# EAGLE design LipSync_Hub_PCB (EAGLE 9.6.2)
AUTHOR: ladyada
Assembly variants: Precert, PostCert
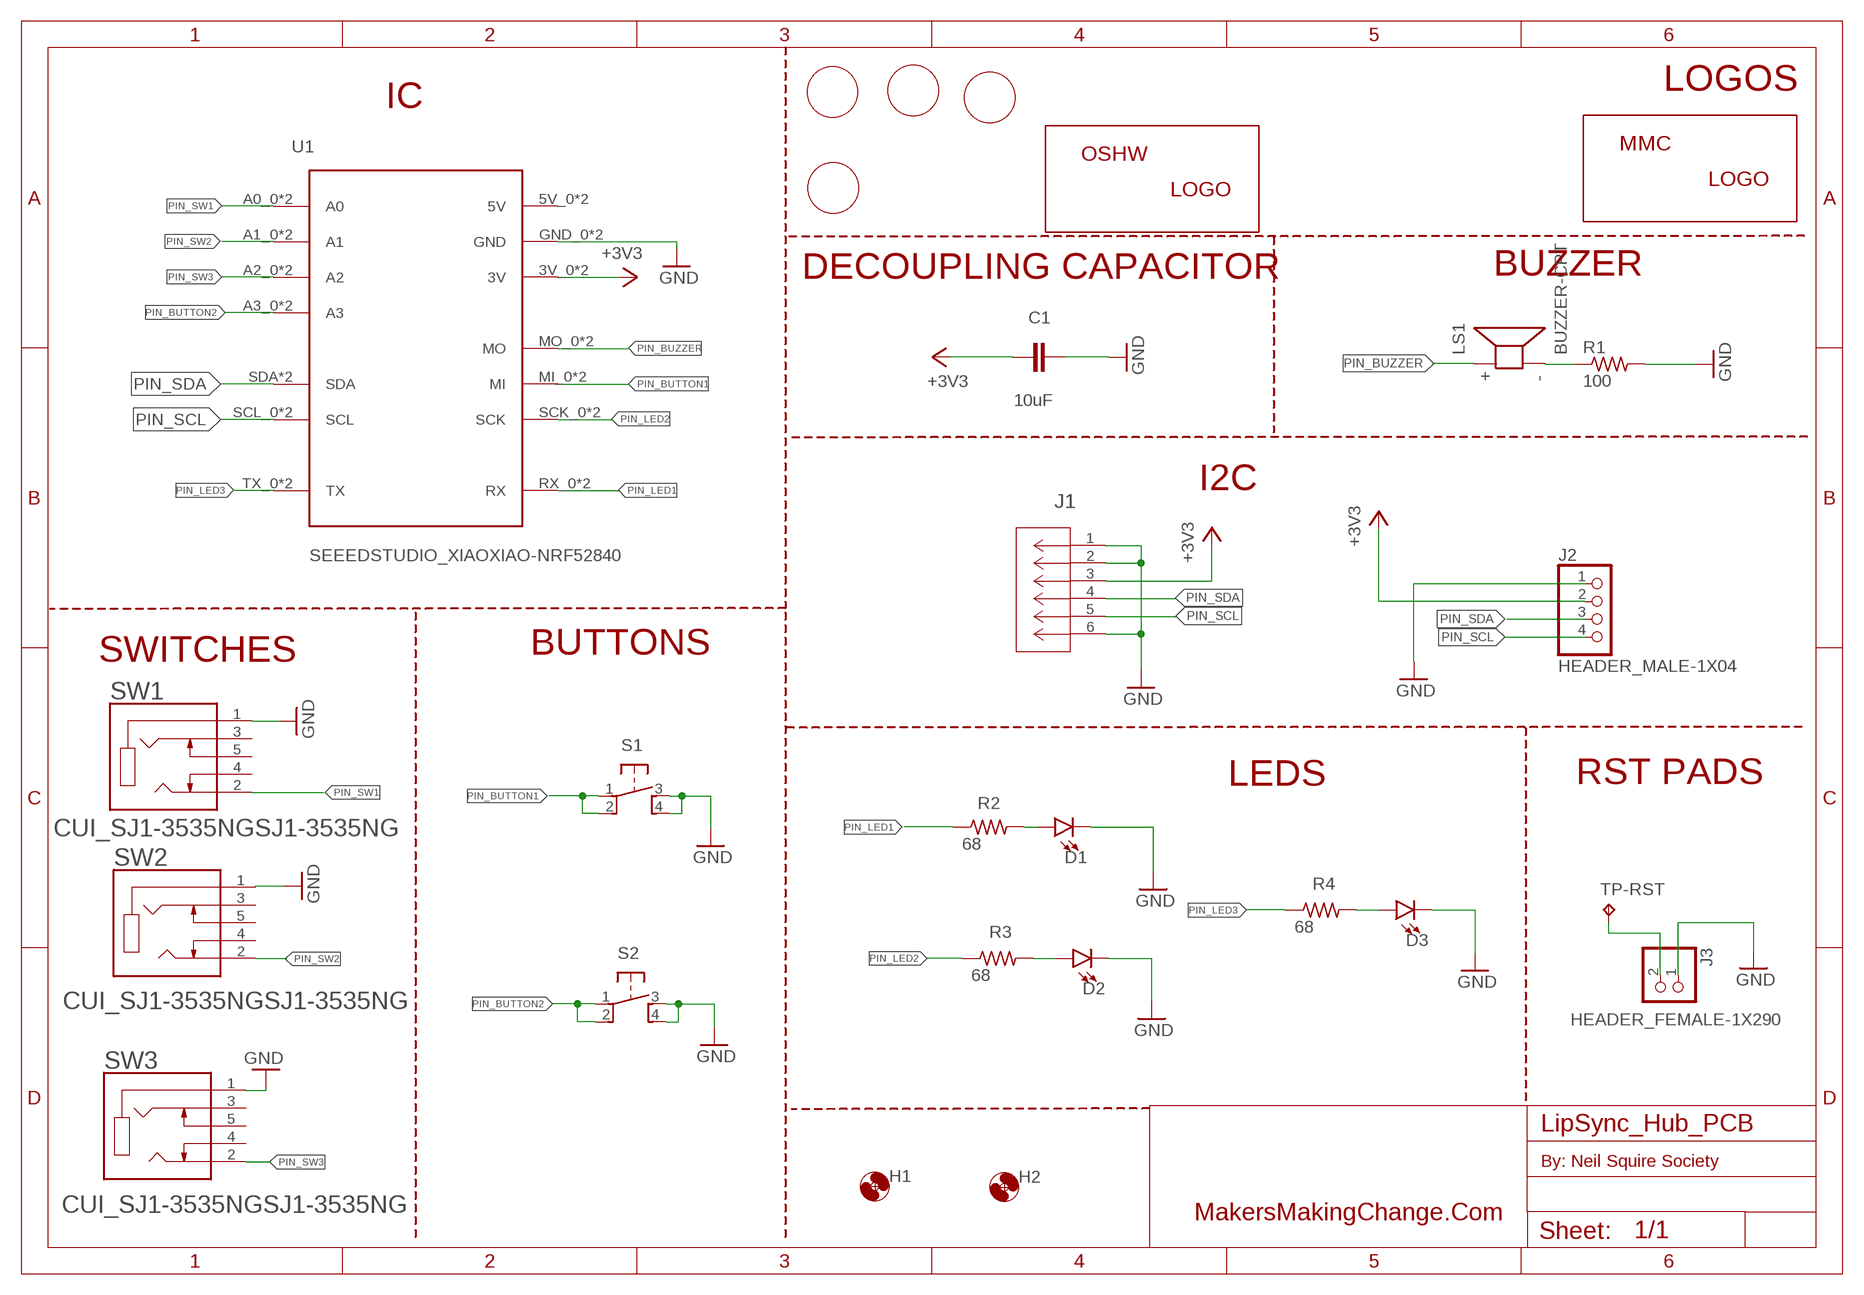
[diagram p0: schematic, sheet 1]

## Parts
C1  10uF  CAPACITOR-050-030-075  [CAP-050-030X075]
D1  LED_5MM-5MM-RED-LONG  [LED_5MM_RED_LONG]
D2  LED_5MM-5MM-RED-LONG  [LED_5MM_RED_LONG]
D3  LED_5MM-5MM-RED-LONG  [LED_5MM_RED_LONG]
H1  MOUNT-HOLE-3MM-CLEAR  [HOLE-3MM-CLEAR]
H2  MOUNT-HOLE-3MM-CLEAR  [HOLE-3MM-CLEAR]
J1  5555165-1  [CONN6_5555165-1]
J2  HEADER_MALE-1X04  [HEADER_MALE-1X04]
J3  HEADER_FEMALE-1X290  [HEADER_FEMALE-1X02_90]
LOGO-BACK  MMC_LABEL-BACK  [LABEL-BACK]
LOGO-FRONT  MMC_LABEL-FRONT  [LABEL-FRONT]
LOGO-LIPSYNC-BACK  MMC_LABEL-LIPSYNC-X-LG  [LABEL-LIPSYNC-X-LG]
LOGO-MMC-BACK  MMC_LOGO-MD  [MMC_MEDIUM_LOGO]
LOGO-NORTH  MMC_LABEL-UP  [LABEL-UP]
LOGO-OSWH  OSHW_LOGO-SM  [OSHW_SMALL_LOGO]  (not fitted in variant Precert)
LS1  BUZZER-CPT  [CUI_CPT-1255C-090]
R1  100  RESISTOR-US-0204/7  [RESISTOR_0205/7]
R2  68  RESISTOR-US-0204/7  [RESISTOR_0205/7]
R3  68  RESISTOR-US-0204/7  [RESISTOR_0205/7]
R4  68  RESISTOR-US-0204/7  [RESISTOR_0205/7]
S1  SWITCH_OMRON-PTH-12  [B3F-5050]
S2  SWITCH_OMRON-PTH-12  [B3F-5050]
SW1  CUI_SJ1-3535NGSJ1-3535NG  [CUI_SJ1-3535NG]
SW2  CUI_SJ1-3535NGSJ1-3535NG  [CUI_SJ1-3535NG]
SW3  CUI_SJ1-3535NGSJ1-3535NG  [CUI_SJ1-3535NG]
TP-RST  TESTPAD_TPB1,27  [TESTPAD_B1,27]
U1  SEEEDSTUDIO_XIAOXIAO-NRF52840  [SEEEDSTUDIO_XIAO_NRF52840]

## Nets
+3V3: C1.2 J1.3 J2.2 U1.3V_0(3V) U1.3V_1(3V)
GND: C1.1 D1.K(C) D2.K(C) D3.K(C) J1.1 J1.2 J1.6 J2.1 J3.1 R1.2 S1.3 S1.4 S2.3 S2.4 SW1.1 SW2.1 SW3.1 U1.GND_0(GND) U1.GND_1(GND)
N$1: LS1.N R1.1
N$2: D2.A R3.2
N$3: J3.2 TP-RST.TP
N$4: D3.A R4.2
N$5: D1.A R2.2
PIN_BUTTON1: S1.1 S1.2 U1.MI_0(MI) U1.MI_1(MI)
PIN_BUTTON2: S2.1 S2.2 U1.A3_0(A3) U1.A3_1(A3)
PIN_BUZZER: LS1.P U1.MO_0(MO) U1.MO_1(MO)
PIN_LED1: R2.1 U1.RX_0(RX) U1.RX_1(RX)
PIN_LED2: R3.1 U1.SCK_0(SCK) U1.SCK_1(SCK)
PIN_LED3: R4.1 U1.TX_0(TX) U1.TX_1(TX)
PIN_SCL: J1.5 J2.4 U1.SCL_0(SCL) U1.SCL_1(SCL)
PIN_SDA: J1.4 J2.3 U1.SDA U1.SDA_0(SDA)
PIN_SW1: SW1.2 U1.A0_0(A0) U1.A0_1(A0)
PIN_SW2: SW2.2 U1.A1_0(A1) U1.A1_1(A1)
PIN_SW3: SW3.2 U1.A2_0(A2) U1.A2_1(A2)
Unconnected: SW1.3 SW1.4 SW1.5 SW2.3 SW2.4 SW2.5 SW3.3 SW3.4 SW3.5 U1.5V_0(5V) U1.5V_1(5V)

## Notes on the sheet
- LOGOS
- IC
- DECOUPLING CAPACITOR | BUZZER
- I2C
- SWITCHES | BUTTONS
- LEDS | RST PADS
- By: Neil Squire Society
- MakersMakingChange.Com

## Library data of the parts
C1 = MMC Eagle:CAPACITOR-
D1-D3 = MMC Eagle:LED_5MM-: LED (Generic) Standard schematic elements and footprints for 5mm, 3mm, 1206, and 0603 sized LEDs. Generic LEDs with no color specified.
H1 H2 = MMC Eagle:MOUNT-HOLE-: MOUNTING HOLE with drill center marker
J1 = MMC Eagle:5555165-1; COPYRIGHT: Copyright (C) 2023 Ultra Librarian. All rights reserved.; MANUFACTURER_PART_NUMBER: 5555165-1; MFR_NAME: TE Connectivity
J2 = MMC Eagle:HEADER_MALE-1X04
J3 = MMC Eagle:HEADER_FEMALE-1X2
LOGO-BACK LOGO-FRONT LOGO-LIPSYNC-BACK LOGO-NORTH = MMC Eagle:MMC_LABEL-
LOGO-MMC-BACK = MMC Eagle:MMC_LOGO-
LOGO-OSWH = MMC Eagle:OSHW_LOGO-
LS1 = MMC Eagle:BUZZER: Buzzer Small round buzzers that operate around the audible 2kHz range. You can use these as speakers to create simple music or user interfaces. Options: PTH - Mini Speaker - PC Mount 12mm 2.048kHz <https://www.sparkfun.com/products/7950> PTH_KIT - Mini Speaker - PC Mount 12mm 2.048kHz <https://www.sparkfun.com/products/7950> KIT simplifies soldering by adding stop mask to one side of the pads. PTH_NO_SILK - Mini Speaker - PC Mount 12mm 2.048kHz <https://www.sparkfun.com/products/7950> No silkscreen indicator of buzzer outline. PTH_KIT_NO_SILK - Mini Speaker - PC Mount 12mm 2.048kHz <https://www.sparkfun.com/products/7950> KIT package w/o silkscreen SMD - Buzzer Audio Magnetic (CCV-084B16) SMD buzzer used on, e.g. the LilyPad Buzzer <https://www.sparkfun.com/products/8463> and RFID USB Reader <https://www.sparkfun.com/products/9963>. SMD_KIT - Buzzer Audio Magnetic (CCV-084B16) SMD Buzzer with elongated pins to make soldering easier. Used on the SparkFun Simon Says - Surface Mount Soldering Kit <https://www.sparkfun.com/products/10935>.
R1-R4 = MMC Eagle:RESISTOR-US-: RESISTOR, American symbol
S1 S2 = MMC Eagle:SWITCH_OMRON: OMRON SWITCH Now with beefier pads!
SW1-SW3 = MMC Eagle:CUI_SJ1-3535NG: SJ1-3535NG 3.50mm (0.141", 1/8", Mini Plug) - Headphone Phone Jack Stereo (3 Conductor, TRS) Connector. You can use these as jacks to create simple switch interfaces. Options: Digikey - CP1-3535NG-ND <https://www.digikey.ca/en/products/detail/cui-devices/SJ1-3535NG/738699> Mouser - 490-SJ1-3535NG <https://www.mouser.ca/ProductDetail/CUI-Devices/SJ1-3535NG?qs=WyjlAZoYn50jUmKVsqeRJw%3D%3D>
TP-RST = MMC_SMD:TESTPAD_TP: Test pad
U1 = MMC Eagle:SEEEDSTUDIO_XIAO

## Board
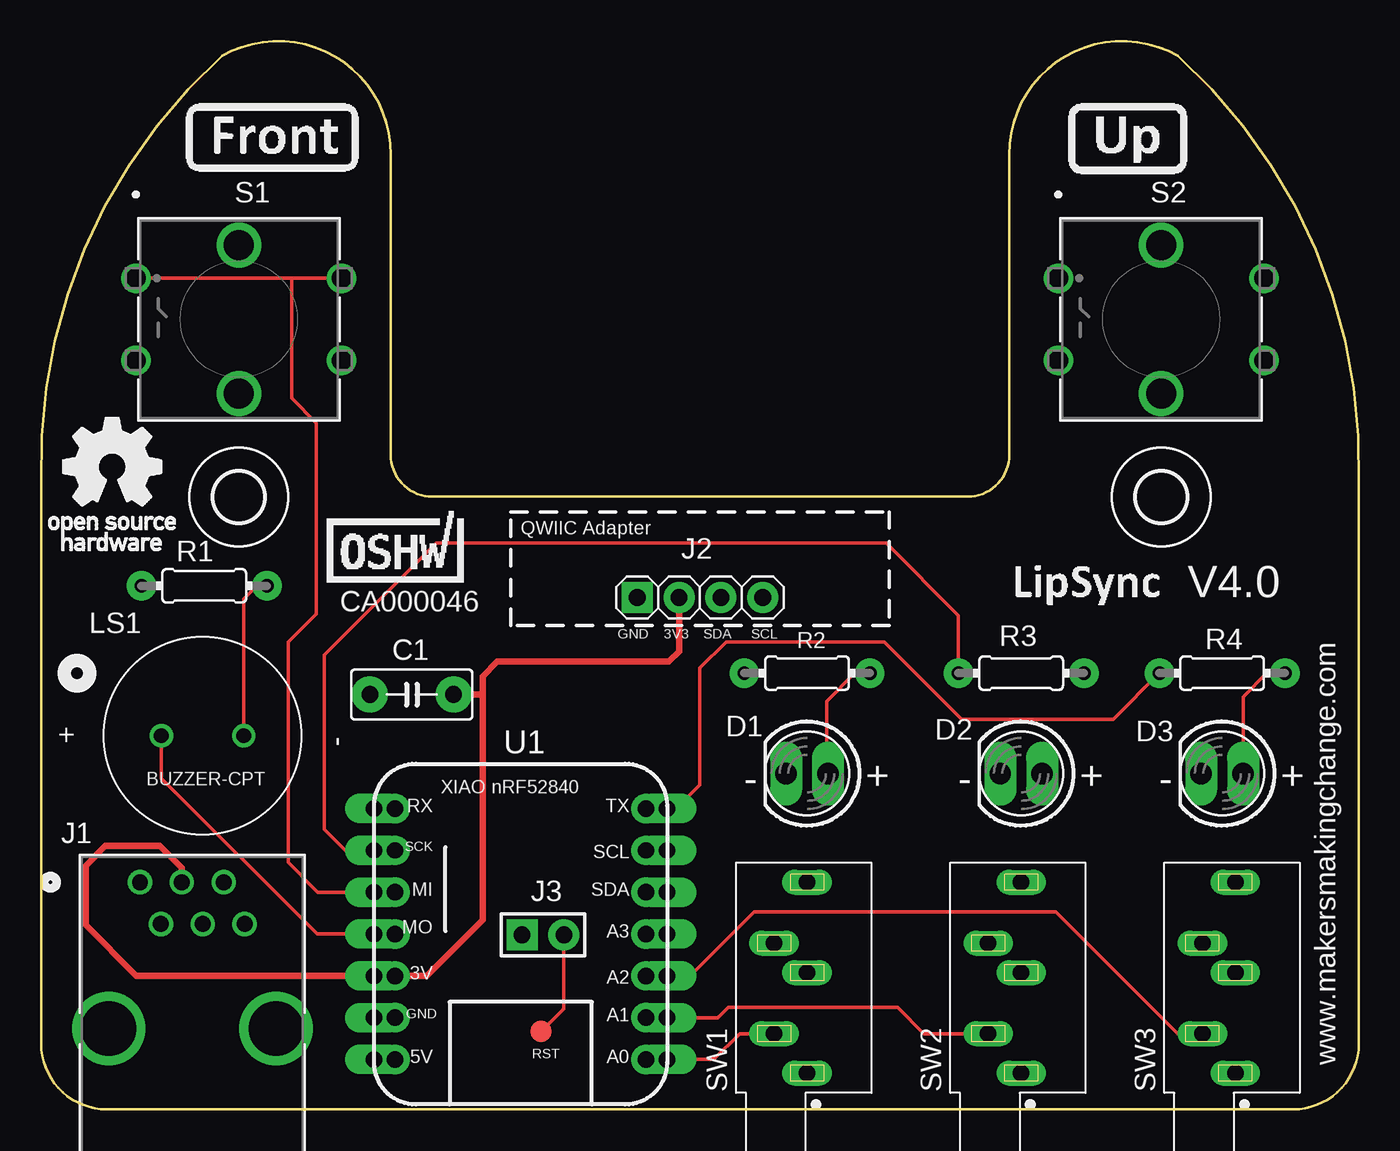
[diagram p1: board, top side]
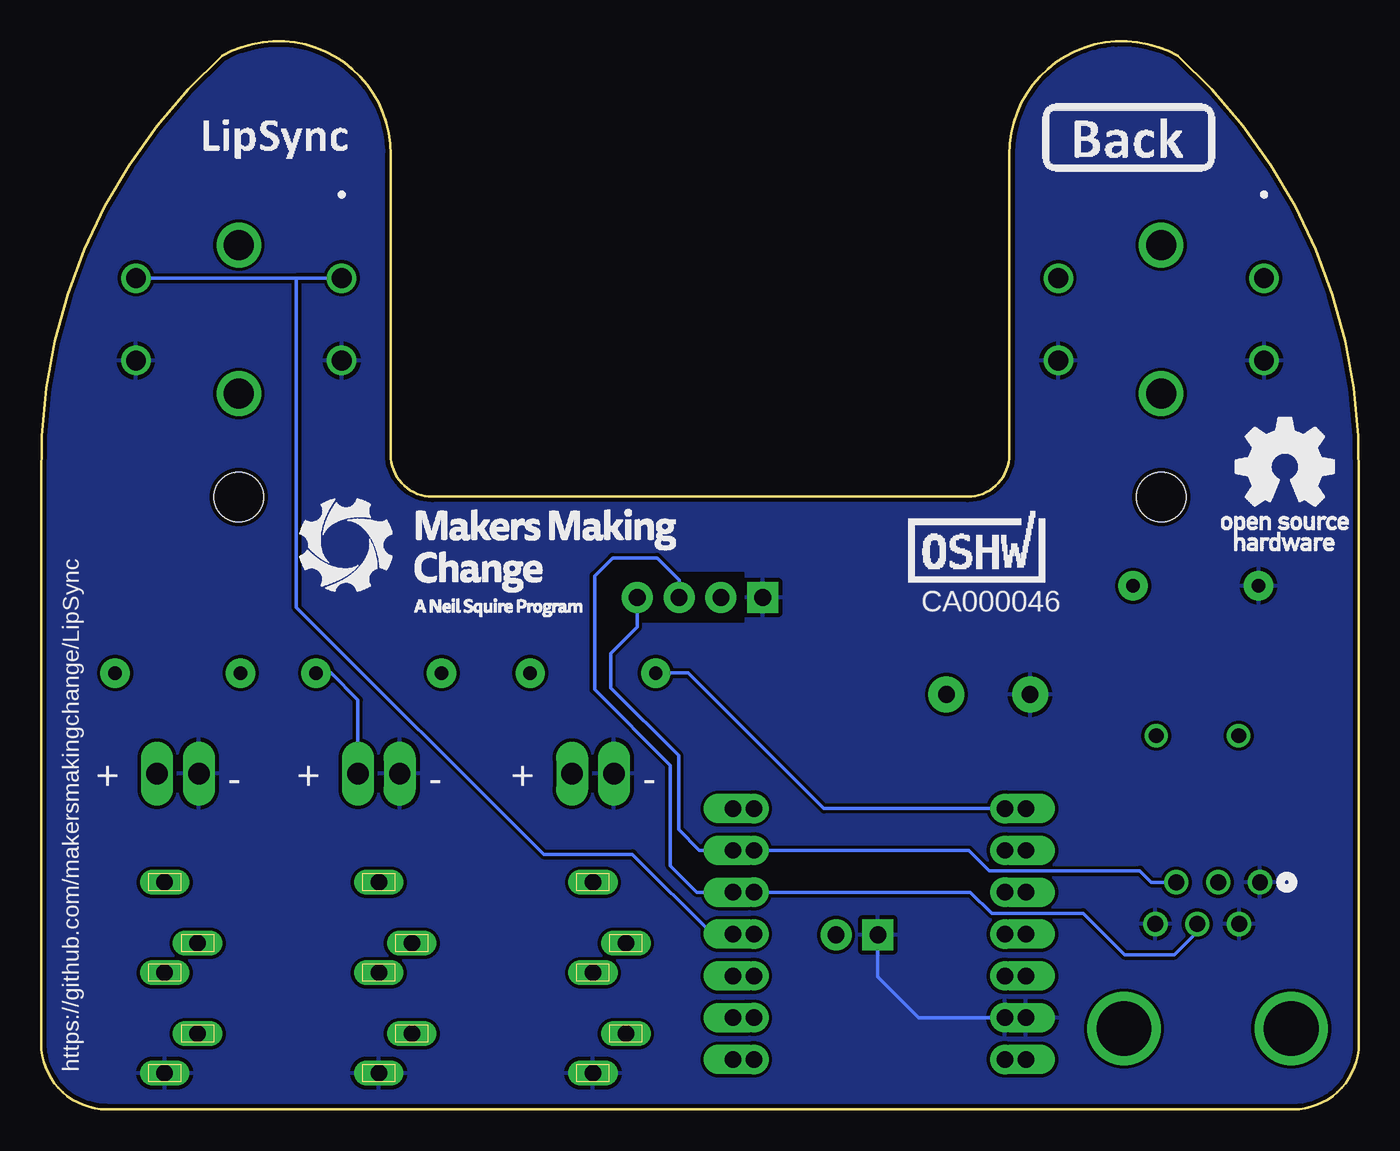
[diagram p2: board, bottom side, seen from below]

Size 80 x 64.89 mm. Coordinates in mm from the lower left corner, seen from the top.
Outline: 76,0 4,0 arc-90 0,4 0,38 arc-50 11,64 arc-120 21.22,58 21.22,39.76 arc90 23.76,37.22 56.24,37.22 arc90 58.78,39.76 58.78,58 arc-120 69,64 arc-50 80,38 80,4 arc-90 76,0
Copper layers (1*16): Top 0.035mm / dielectric 1.5mm / Bottom 0.035mm
Design rules "adafruit 8-8 *": minimum track width 8mil, minimum drill 15.5mil, track to track 8mil, track to pad 8mil, pad to pad 8mil, via to via 8mil, smd to smd 8mil, copper to edge 10mil, drill to drill 8mil, minimum pad ring 10mil, minimum via ring 8mil, stop-mask expansion 2mil, vias tented up to drill 20mil, thermal gap 10mil

### Footprints (pad centres in the part's own frame; a part is rotated, then mirrored left to right if it is on the bottom)
CAP-050-030X075 = drill 1.016 pad 2.184: 1 -2.54,0; 2 2.54,0
LED_5MM_RED_LONG = drill 1.3 pad 1.676 long: A -1.27,0; K 1.27,0
HOLE-3MM-CLEAR = hole 3: 0,0
CONN6_5555165-1 = drill 0.965 pad 1.473: 1 0,0; 2 1.27,-2.54; 3 2.54,0; 4 3.81,-2.54; 5 5.08,0; 6 6.35,-2.54 | drill 3.327 pad 3.327: 7 -1.905,-8.89; 8 8.255,-8.89
HEADER_MALE-1X04 = drill 1.016 pad 1.88 square: 1 -3.81,0 | drill 1.016 pad 1.88: 2 -1.27,0; 3 1.27,0; 4 3.81,0
HEADER_FEMALE-1X02_90 = drill 1.016 pad 1.88 square: 1 0,0 | drill 1.016 pad 1.88: 2 2.54,0
CUI_CPT-1255C-090 = drill 0.9: N 2.5,0; P -2.5,0
RESISTOR_0205/7 = drill 0.813 pad 1.778: 1 -3.81,0; 2 3.81,0
B3F-5050 = drill 1.194 pad 1.702: 1 -6.248,2.489; 2 6.248,2.489; 3 -6.248,-2.515; 4 6.248,-2.515 | drill 1.803 pad 1.803: 5 0,4.496; 6 0,-4.521
CUI_SJ1-3535NG = drill 1 long: 1 0,0; 2 2.4,2; 3 7.9,2; 4 11.6,0; 5 6.1,0
TESTPAD_B1,27 = smd 1.27 x 1.27: TP 0,0
SEEEDSTUDIO_XIAO_NRF52840 = drill 1 pad 1.778 long: 3V_0 17.78,12.887; 5V_0 17.78,17.967; A0_0 0,17.967; A1_0 0,15.427; A2_0 0,12.887; A3_0 0,10.347; GND_0 17.78,15.427; MI_0 17.78,7.807; MO_0 17.78,10.347; RX_0 17.78,2.727; SCK_0 17.78,5.267; SCL_0 0,5.267; SDA_0 0,7.807; TX_0 0,2.727 | drill 1 pad 1.778: 3V_1 16.51,12.887; 5V_1 16.51,17.967; A0_1 1.27,17.967; A1_1 1.27,15.427; A2_1 1.27,12.887; A3_1 1.27,10.347; GND_1 16.51,15.427; MI_1 16.51,7.807; MO_1 16.51,10.347; RX_1 16.51,2.727; SCK_1 16.51,5.267; SCL_1 1.27,5.267; SDA 1.27,7.807; TX_1 1.27,2.727

### Placement (x,y rotation side)
C1  22.5,25.2 0 top
D1  46.5,20.4 180 top
D2  59.5,20.4 180 top
D3  71.7,20.4 180 top
H1  12,37.2 0 top
H2  68,37.2 0 top
J1  6,13.8 0 top
J2  40,31.1 0 top
J3  29.2,10.6 0 top
LOGO-BACK  14,59 0 bottom
LOGO-FRONT  14,59 0 top
LOGO-LIPSYNC-BACK  65.2,59 0 bottom
LOGO-MMC-BACK  52.9,33.5 0 bottom
LOGO-NORTH  66,59 0 top
LOGO-OSWH  4.4,38 0 bottom
LS1  9.8,22.7 0 top
R1  9.9,31.8 180 top
R2  46.5,26.5 0 top
R3  59.5,26.5 0 top
R4  71.7,26.5 0 top
S1  12,48 0 top
S2  68,48 0 top
SW1  46.5,2.2 90 top
SW2  59.5,2.2 90 top
SW3  72.5,2.2 90 top
TP-RST  30.36,4.74 0 top
U1  38,21 180 top
U$1  [OSHW_SMALL_LOGO]  4.4,38 0 top
U$2  CA000046  [CERT-SMALL-SILK]  23.2,32 0 bottom
U$3  [LABEL-LIPSYNC-X-LG]  64.1,31.9 0 top
U$4  CA000046  [CERT-SMALL-SILK]  21.5,32 0 top

### Tracks (layer width: path | path; a pad name or v marks a point on that pad's centre or on a via)
+3V3
  Top 0.406: 26.8,25.2 26.8,11.5 23.41,8.11 U1.3V_1 U1.3V_0 5.79,8.11 2.7,11.2 2.7,14.8 3.9,16 7.2,16 8.54,14.66 J1.3 | 26.8,25.2 26.8,26.3 27.7,27.2 38.1,27.2 38.73,27.83 J2.2 | C1.2 26.8,25.2
GND
  Bottom 0.203: U1.GND_1 26.72,5.57 29.2,8.05 J3.1
  pour Bottom: 0,65 80,65 80,0 0,0
  cutout Bottom: 37.36,32.57 45.08,32.57 45.08,29.63 37.36,29.63
N$1
  Top 0.203: LS1.N 12.3,31 13.1,31.8 R1.1
N$2
  Bottom 0.203: D2.A 60.77,24.87 62.4,26.5 R3.2
N$3
  Top 0.203: TP-RST.TP 31.74,6.12 J3.2
N$4
  Top 0.203: R4.2 74.41,26.5 72.97,25.06 D3.A
N$5
  Top 0.203: R2.2 49.41,26.5 47.7,24.79 47.7,19.47 D1.A
PIN_BUTTON1
  Top 0.203: S1.1 15.2,50.49 | 15.2,50.49 S1.2 | U1.MI_1 U1.MI_0 16.81,13.19 15,15 15,28.4 16.7,30.1 16.7,41.7 15.2,43.2 15.2,50.49
PIN_BUTTON2
  Bottom 0.203: S2.2 S2.1 64.5,50.49 64.5,30.5 49.5,15.5 44.1,15.5 39.25,10.65 U1.A3_0 U1.A3_1
PIN_BUZZER
  Top 0.203: LS1.P 7.3,20.1 16.75,10.65 U1.MO_0 U1.MO_1
PIN_LED1
  Bottom 0.203: R2.1 40.7,26.5 32.47,18.27 U1.RX_1 U1.RX_0
PIN_LED2
  Top 0.203: U1.SCK_0 U1.SCK_1 18.47,15.73 17.2,17 17.2,27.6 24,34.4 51.3,34.4 55.69,30.01 R3.1
PIN_LED3
  Top 0.203: U1.TX_1 U1.TX_0 38.57,18.27 40,19.7 40,26.8 41.6,28.4 51.2,28.4 55.9,23.7 65.09,23.7 R4.1
PIN_SCL
  Bottom 0.203: J2.4 43.81,29.3 45.41,27.7 45.41,25.61 41.3,21.5 41.3,17 40.03,15.73 U1.SCL_0 U1.SCL_1 23.68,15.73 22.45,14.5 13.3,14.5 12.6,13.8 J1.5
PIN_SDA
  Bottom 0.203: J1.4 9.81,10.79 11.2,9.4 14.23,9.4 16.74,11.91 22.3,11.91 23.58,13.19 U1.SDA U1.SDA_0 40.19,13.19 41.8,14.8 41.8,20.9 46.4,25.5 46.4,32.4 45.3,33.5 42.6,33.5 41.27,32.17 J2.3
PIN_SW1
  Top 0.203: SW1.2 42.4,4.6 40.83,3.03 U1.A0_0 U1.A0_1
PIN_SW2
  Top 0.203: SW2.2 53.6,4.6 52,6.2 41.7,6.2 41.07,5.57 U1.A1_0 U1.A1_1
PIN_SW3
  Top 0.203: SW3.2 69,4.6 61.6,12 43.3,12 39.41,8.11 U1.A2_0 U1.A2_1

### Text on the board
tPlace: QWIIC Adapter | V4.0 | GND | 3V3 | SDA | SCL | RST | www.makersmakingchange.com
bPlace: https://github.com/makersmakingchange/LipSync